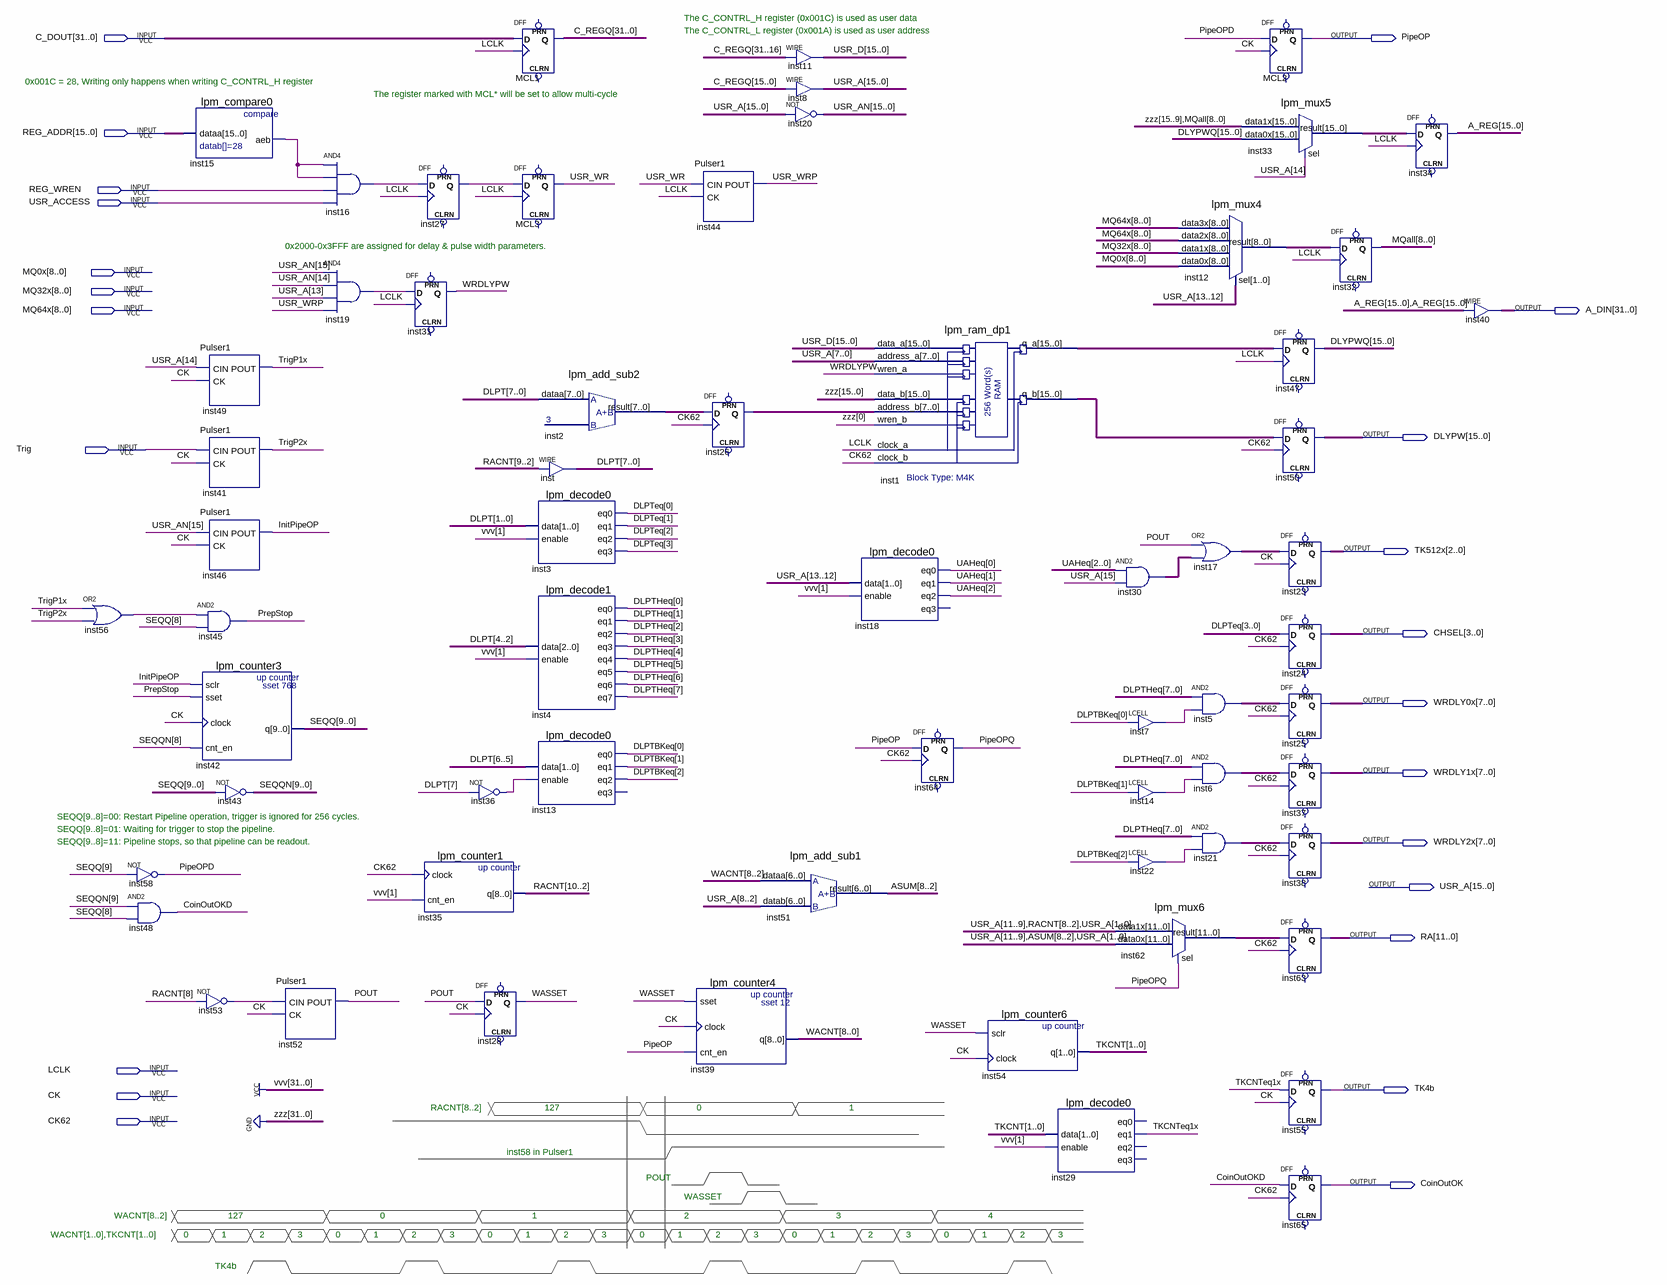
[diagram p0: schematic sheet]
// Quartus schematic Timing3.bdf as structural Verilog: 63 symbols, 23 pins
module Timing3 (
  input  [31:0] C_DOUT,
  input  [15:0] REG_ADDR,
  input  REG_WREN,
  input  USR_ACCESS,
  input  [8:0] MQ0x,
  input  [8:0] MQ32x,
  input  [8:0] MQ64x,
  input  Trig,
  input  LCLK,
  input  CK,
  input  CK62,
  output PipeOP,
  output [31:0] A_DIN,
  output [15:0] DLYPW,
  output [2:0] TK512x,
  output [3:0] CHSEL,
  output [7:0] WRDLY0x,
  output [7:0] WRDLY1x,
  output [7:0] WRDLY2x,
  output [15:0] USR_A,
  output [11:0] RA,
  output TK4b,
  output CoinOutOK
);

  wire CoinOutOKD, InitPipeOP, inst7_out, inst14_out, inst15_aeb, inst16_out, inst19_out, inst22_out,
       inst27_q, inst36_out, inst53_out, inst56_out, PipeOPD, PipeOPQ, POUT, PrepStop, TKCNTeq1x, TrigP1x,
       TrigP2x, USR_WR, USR_WRP, WASSET, WRDLYPW;
  wire [1:0] TKCNT;
  wire [2:0] DLPTBKeq, inst17_out, inst30_out, UAHeq;
  wire [3:0] DLPTeq;
  wire [7:0] DLPT, DLPTHeq, inst2_result, inst5_out, inst6_out, inst21_out, inst26_q;
  wire [8:0] inst12_result, MQall, WACNT;
  wire [8:2] ASUM;
  wire [9:0] SEQQ, SEQQN;
  wire [10:2] RACNT;
  wire [11:0] inst62_result;
  wire [15:0] A_REG, DLYPWQ, inst1_q_a, inst1_q_b, inst33_result, USR_AN, USR_D;
  wire [31:0] C_REGQ;

  or inst56 (inst56_out, TrigP1x, TrigP2x);
  not inst58 (PipeOPD, SEQQ[9]);
  and inst48 (CoinOutOKD, SEQQN[9], SEQQ[8]);
  lpm_compare0 inst15 (.dataa(REG_ADDR), .aeb(inst15_aeb));
  Pulser1 inst49 (.CIN(USR_A[14]), .CK(CK), .POUT(TrigP1x));
  Pulser1 inst41 (.CIN(Trig), .CK(CK), .POUT(TrigP2x));
  Pulser1 inst46 (.CIN(USR_AN[15]), .CK(CK), .POUT(InitPipeOP));
  and inst45 (PrepStop, inst56_out, SEQQ[8]);
  lpm_counter3 inst42 (.sclr(InitPipeOP), .sset(PrepStop), .clock(CK), .cnt_en(SEQQN[8]), .q(SEQQ));
  assign SEQQN = ~SEQQ;  // NOT inst43, 10 bits wide
  not inst53 (inst53_out, RACNT[8]);
  Pulser1 inst52 (.CIN(inst53_out), .CK(CK), .POUT(POUT));
  and inst16 (inst16_out, inst15_aeb, inst15_aeb, REG_WREN, USR_ACCESS);
  and inst19 (inst19_out, USR_AN[15], USR_AN[14], USR_A[13], USR_WRP);
  DFF inst27 (.CLK(LCLK), .D(inst16_out), .Q(inst27_q));  // open: CLRN, PRN
  DFF inst31 (.CLK(LCLK), .D(inst19_out), .Q(WRDLYPW));  // open: CLRN, PRN
  lpm_counter1 inst35 (.clock(CK62), .cnt_en(1'b1), .q(RACNT));
  not inst36 (inst36_out, DLPT[7]);
  DFF inst28 (.CLK(CK), .D(POUT), .Q(WASSET));  // open: CLRN, PRN
  DFF MCL1[31:0] (.CLK(LCLK), .D(C_DOUT), .Q(C_REGQ));  // open: CLRN, PRN
  DFF MCL3 (.CLK(LCLK), .D(inst27_q), .Q(USR_WR));  // open: CLRN, PRN
  lpm_add_sub2 inst2 (.dataa(DLPT), .result(inst2_result));
  assign DLPT = RACNT[9:2];  // WIRE inst
  lpm_decode0 inst3 (
    .data(DLPT[1:0]), .enable(1'b1), .eq0(DLPTeq[0]), .eq1(DLPTeq[1]), .eq2(DLPTeq[2]), .eq3(DLPTeq[3]));
  lpm_decode1 inst4 (
    .data(DLPT[4:2]), .enable(1'b1), .eq0(DLPTHeq[0]), .eq1(DLPTHeq[1]), .eq2(DLPTHeq[2]), .eq3(DLPTHeq[3]),
    .eq4(DLPTHeq[4]), .eq5(DLPTHeq[5]), .eq6(DLPTHeq[6]), .eq7(DLPTHeq[7]));
  lpm_decode0 inst13 (
    .data(DLPT[6:5]), .enable(inst36_out), .eq0(DLPTBKeq[0]), .eq1(DLPTBKeq[1]), .eq2(DLPTBKeq[2]));  // open: eq3
  Pulser1 inst44 (.CIN(USR_WR), .CK(LCLK), .POUT(USR_WRP));
  lpm_counter4 inst39 (.sset(WASSET), .clock(CK), .cnt_en(PipeOP), .q(WACNT));
  DFF inst26[7:0] (.CLK(CK62), .D(inst2_result), .Q(inst26_q));  // open: CLRN, PRN
  assign USR_D = C_REGQ[31:16];  // WIRE inst11
  assign USR_A = C_REGQ[15:0];  // WIRE inst8
  assign USR_AN = ~USR_A;  // NOT inst20, 16 bits wide
  lpm_add_sub1 inst51 (.dataa(WACNT[8:2]), .datab(USR_A[8:2]), .result(ASUM));
  lpm_ram_dp1 inst1 (
    .data_a(USR_D), .address_a(USR_A[7:0]), .wren_a(WRDLYPW), .data_b({16{1'b0}}), .address_b(inst26_q),
    .wren_b(1'b0), .clock_a(LCLK), .clock_b(CK62), .q_a(inst1_q_a), .q_b(inst1_q_b));
  lpm_decode0 inst18 (.data(USR_A[13:12]), .enable(1'b1), .eq0(UAHeq[0]), .eq1(UAHeq[1]), .eq2(UAHeq[2]));  // open: eq3
  DFF inst64 (.CLK(CK62), .D(PipeOP), .Q(PipeOPQ));  // open: CLRN, PRN
  lpm_counter6 inst54 (.sclr(WASSET), .clock(CK), .q(TKCNT));
  lpm_decode0 inst29 (.data(TKCNT), .enable(1'b1), .eq1(TKCNTeq1x));  // open: eq0, eq2, eq3
  assign inst30_out = UAHeq & {3{USR_A[15]}};  // AND2 inst30, 3 bits wide
  LCELL inst7 (.IN(DLPTBKeq[0]), .OUT(inst7_out));
  LCELL inst14 (.IN(DLPTBKeq[1]), .OUT(inst14_out));
  LCELL inst22 (.IN(DLPTBKeq[2]), .OUT(inst22_out));
  lpm_mux6 inst62 (
    .data1x({USR_A[11:9], RACNT[8:2], USR_A[1:0]}), .data0x({USR_A[11:9], ASUM, USR_A[1:0]}), .sel(PipeOPQ),
    .result(inst62_result));
  lpm_mux4 inst12 (
    .data3x(MQ64x), .data2x(MQ64x), .data1x(MQ32x), .data0x(MQ0x), .sel(USR_A[13:12]), .result(inst12_result));
  assign inst17_out = {3{POUT}} | inst30_out;  // OR2 inst17, 3 bits wide
  assign inst5_out = DLPTHeq & {8{inst7_out}};  // AND2 inst5, 8 bits wide
  assign inst6_out = DLPTHeq & {8{inst14_out}};  // AND2 inst6, 8 bits wide
  assign inst21_out = DLPTHeq & {8{inst22_out}};  // AND2 inst21, 8 bits wide
  lpm_mux5 inst33 (.data1x({{7{1'b0}}, MQall}), .data0x(DLYPWQ), .sel(USR_A[14]), .result(inst33_result));
  DFF MCL2 (.CLK(CK), .D(PipeOPD), .Q(PipeOP));  // open: CLRN, PRN
  DFF inst47[15:0] (.CLK(LCLK), .D(inst1_q_a), .Q(DLYPWQ));  // open: CLRN, PRN
  DFF inst50[15:0] (.CLK(CK62), .D(inst1_q_b), .Q(DLYPW));  // open: CLRN, PRN
  DFF inst23[2:0] (.CLK(CK), .D(inst17_out), .Q(TK512x));  // open: CLRN, PRN
  DFF inst24[3:0] (.CLK(CK62), .D(DLPTeq), .Q(CHSEL));  // open: CLRN, PRN
  DFF inst25[7:0] (.CLK(CK62), .D(inst5_out), .Q(WRDLY0x));  // open: CLRN, PRN
  DFF inst37[7:0] (.CLK(CK62), .D(inst6_out), .Q(WRDLY1x));  // open: CLRN, PRN
  DFF inst38[7:0] (.CLK(CK62), .D(inst21_out), .Q(WRDLY2x));  // open: CLRN, PRN
  DFF inst63[11:0] (.CLK(CK62), .D(inst62_result), .Q(RA));  // open: CLRN, PRN
  DFF inst55 (.CLK(CK), .D(TKCNTeq1x), .Q(TK4b));  // open: CLRN, PRN
  DFF inst65 (.CLK(CK62), .D(CoinOutOKD), .Q(CoinOutOK));  // open: CLRN, PRN
  DFF inst32[8:0] (.CLK(LCLK), .D(inst12_result), .Q(MQall));  // open: CLRN, PRN
  DFF inst34[15:0] (.CLK(LCLK), .D(inst33_result), .Q(A_REG));  // open: CLRN, PRN
  assign A_DIN = {A_REG, A_REG};  // WIRE inst40

  // Notes on the sheet:
  //   The C_CONTRL_H register (0x001C) is used as user data
  //   The C_CONTRL_L register (0x001A) is used as user address
  //   0x001C = 28, Writing only happens when writing C_CONTRL_H register
  //   The register marked with MCL* will be set to allow multi-cycle
  //   0x2000-0x3FFF are assigned for delay & pulse width parameters.
  //   SEQQ[9..8]=00: Restart Pipeline operation, trigger is ignored for 256 cycles.
  //   SEQQ[9..8]=01: Waiting for trigger to stop the pipeline.
  //   SEQQ[9..8]=11: Pipeline stops, so that pipeline can be readout.
  //   RACNT[8..2]
  //   127
  //   0
  //   1
  //   inst58 in Pulser1
  //   POUT
  //   WASSET
  //   WACNT[8..2]
  //   127
  //   0
  //   1
  //   2
  //   3
  //   4
  //   WACNT[1..0],TKCNT[1..0]
  //   0
  //   1
  //   2
  //   3
  //   0
  //   1
  //   2
  //   3
  //   0
  //   1
  //   2
  //   3
  //   0
  //   1
  //   2
  //   3
  //   0
  //   1
  //   2
  //   3
  //   0
  //   1
  //   2
  //   3
  //   TK4b
endmodule
